# Altium schematic sheet main.SchDoc
size A3
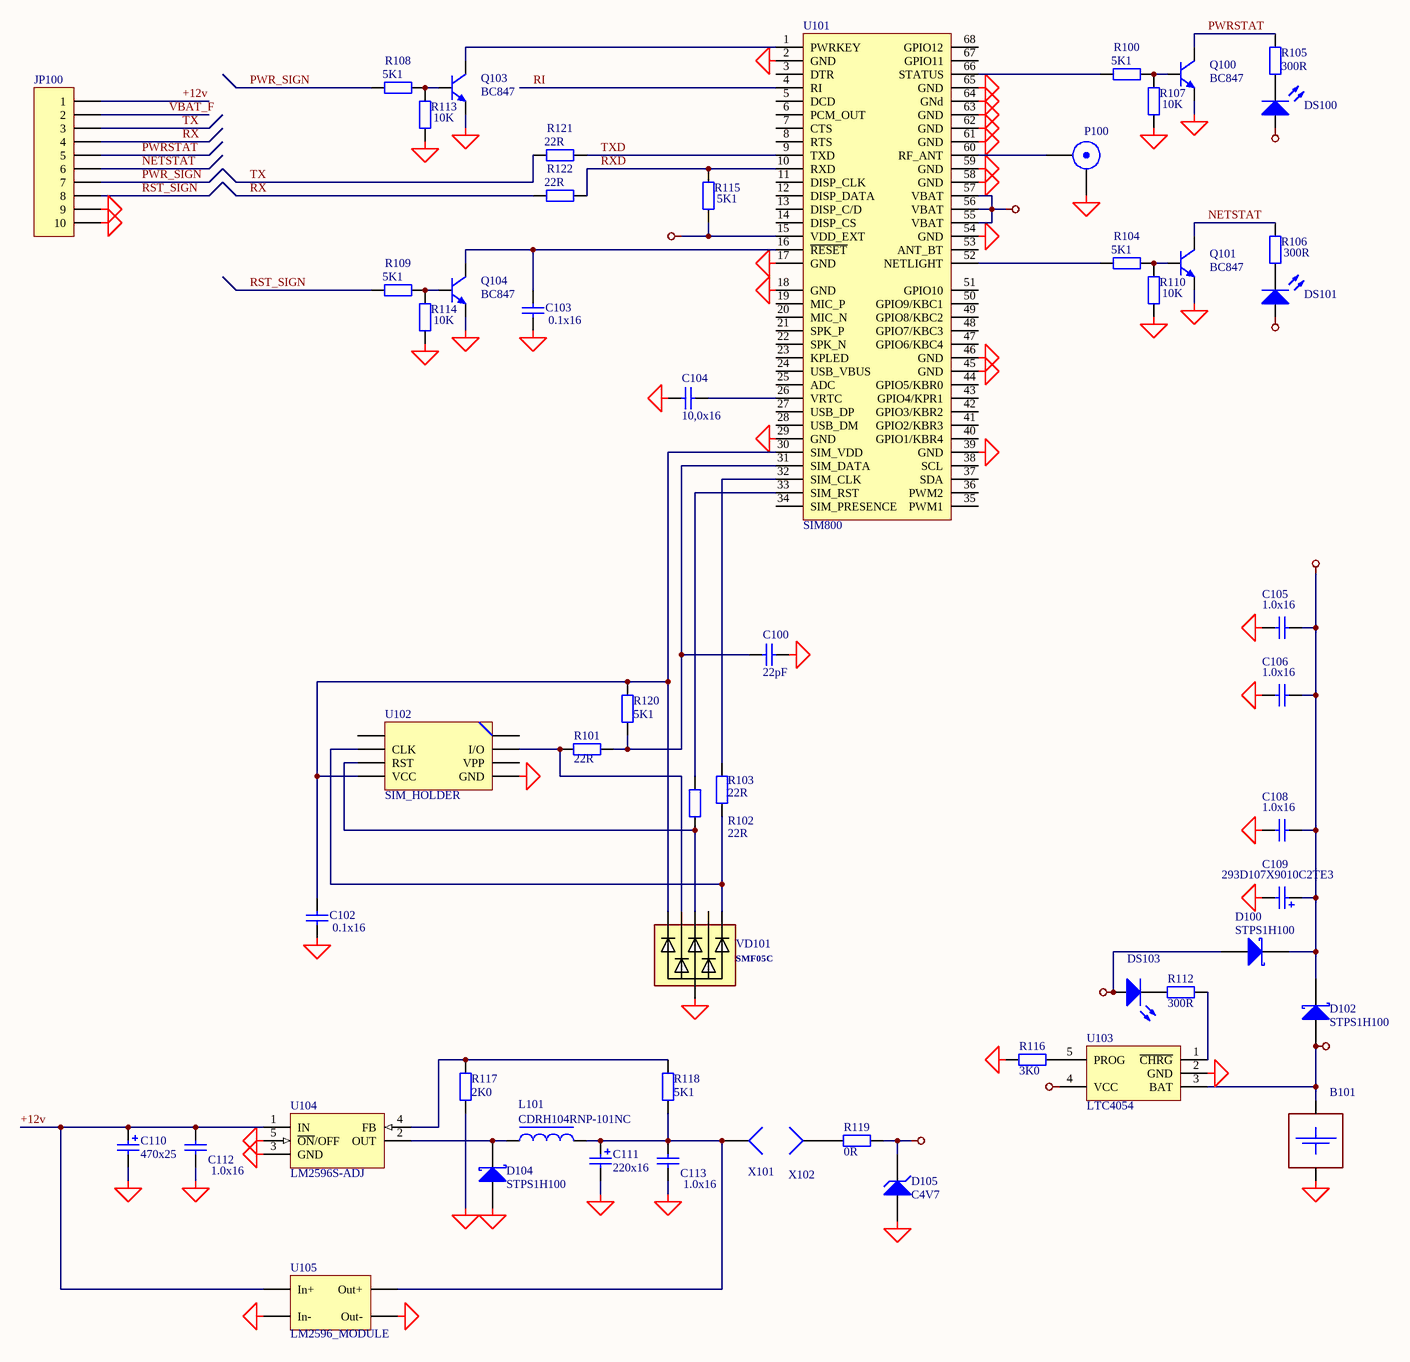
[diagram p0: main.SchDoc]

## Parts
B101  BAT18650_HOLDER  [BAT18650_HOLDER]  (value not drawn)
C100  22pF  [_1206]
C102  0.1x16  [_1206]
C103  0.1x16  [_1206]
C104  10,0x16  [_1206]
C105  1.0x16  [_1206]
C106  1.0x16  [_1206]
C108  1.0x16  [_1206]
C109  293D107X9010C2TE3  [CAP_EL_6_3]
C110  470x25  [el5]
C111  220x16  [el3]
C112  1.0x16  [_1206]
C113  1.0x16  [_1206]
D100  STPS1H100  [MBRS140]
D102  STPS1H100  [MBRS140]
D104  STPS1H100  [MBRS140]
D105  C4V7  [_1206d]
DS100  LED0  [el3]  (value not drawn)
DS101  LED0  [el3]  (value not drawn)
DS103  LED0  [el3]  (value not drawn)
JP100  PLDH-10  [HDR2X5]  (value not drawn)
L101  CDRH104RNP-101NC  [CDRH104R]
P100  SMB  [SMB_V-RJ45]  (value not drawn)
Q100  BC847  [SO-G3]
Q101  BC847  [SO-G3]
Q103  BC847  [SO-G3]
Q104  BC847  [SO-G3]
R100  5K1  [_1206]
R101  22R  [_1206]
R102  22R  [_1206]
R103  22R  [_1206]
R104  5K1  [_1206]
R105  300R  [_1206]
R106  300R  [_1206]
R107  10K  [_1206]
R108  5K1  [_1206]
R109  5K1  [_1206]
R110  10K  [_1206]
R112  300R  [_1206]
R113  10K  [_1206]
R114  10K  [_1206]
R115  5K1  [_1206]
R116  3K0  [_1206]
R117  2K0  [_1206]
R118  5K1  [_1206]
R119  0R  [_1206]
R120  5K1  [_1206]
R121  22R  [_1206]
R122  22R  [_1206]
U101  SIM800  [SIM800]
U102  SIM_HOLDER  [SIM_HOLDER_1]
U103  LTC4054  [SO-G5/P.95]
U104  LM2596S-ADJ  [SIP-G5/Y2.1]
U105  LM2596_MODULE  [LM2596_MODULE_1]
VD101  SMF05C  [sot363]
X101  Socket  [PIN1]  (value not drawn)
X102  Socket  [PIN1]  (value not drawn)

## Nets
+5v: D100.1(A) D105.2(K) DS103.1(A) R119.2 U103.4(VCC)
GND: B101.2(-) C100.1 C102.1 C103.1 C104.2 C105.1 C106.1 C108.1 C109.2 C110.2 C111.2 C112.1 C113.1 D104.1(A) D105.1(A) JP100.9 JP100.10 P100.2(Y) Q100.2(E) Q101.2(E) Q103.2(E) Q104.2(E) R107.2 R110.2 R113.2 R114.2 R116.2 R117.2 U101.2(GND) U101.17(GND) U101.18(GND) U101.29(GND) U101.39(GND) U101.45(GND) U101.46(GND) U101.54(GND) U101.58(GND) U101.59(GND) U101.61(GND) U101.62(GND) U101.63(GND) U101.64(GNd) U101.65(GND) U102.5(GND) U103.2(GND) U104.3(GND) U104.5(~{ON}/OFF) U105.2(In-) U105.3(Out-) VD101.2
VBAT: C105.2 C106.2 C108.2 C109.1 D100.2(K) D102.2(K) DS100.1(A) DS101.1(A) U101.55(VBAT) U101.56(VBAT) U101.57(VBAT)
VBAT_F: B101.1(+) D102.1(A) JP100.2 U103.3(BAT)
VDD_EXT: R115.2 U101.15(VDD_EXT)
+12v: C110.1 C112.2 JP100.1 U104.1(IN) U105.1(In+)
NETSTAT: JP100.6 Q101.3(C) R106.1
PWR_SIGN: JP100.7 R108.2
PWRSTAT: JP100.5 Q100.3(C) R105.2
RI: U101.4(RI)
RST_SIGN: JP100.8 R109.2
RX: JP100.4 R122.2
RXD: R115.1 R122.1 U101.10(RXD)
TX: JP100.3 R121.2
TXD: R121.1 U101.9(TXD)
NetC100_2: C100.2 R101.1 R120.2 U101.31(SIM_DATA)
NetC102_2: C102.2 R120.1 U101.30(SIM_VDD) U102.4(VCC) VD101.1
NetC103_2: C103.2 Q104.3(C) U101.16(~{RESET})
NetC104_1: C104.1 U101.26(VRTC)
NetC111_1: C111.1 C113.2 L101.2 R118.2 U105.4(Out+) X101.1
NetD104_2: D104.2(K) L101.1 U104.2(OUT)
NetDS100_2: DS100.2(K) R105.1
NetDS101_2: DS101.2(K) R106.2
NetDS103_2: DS103.2(K) R112.2
NetP100_1: P100.1(X) U101.60(RF_ANT)
NetQ100_1: Q100.1(B) R100.1 R107.1
NetQ101_1: Q101.1(B) R104.1 R110.1
NetQ103_1: Q103.1(B) R108.1 R113.1
NetQ103_3: Q103.3(C) U101.1(PWRKEY)
NetQ104_1: Q104.1(B) R109.1 R114.1
NetR100_2: R100.2 U101.66(STATUS)
NetR101_2: R101.2 U102.7(I/O) VD101.3
NetR102_1: R102.1 U101.33(SIM_RST)
NetR102_2: R102.2 U102.3(RST) VD101.4
NetR103_1: R103.1 U101.32(SIM_CLK)
NetR103_2: R103.2 U102.2(CLK) VD101.6
NetR104_2: R104.2 U101.52(NETLIGHT)
NetR112_1: R112.1 U103.1(~{CHRG})
NetR116_1: R116.1 U103.5(PROG)
NetR117_1: R117.1 R118.1 U104.4(FB)
NetR119_1: R119.1 X102.1

Not connected (* = marked no-connect by the designer): U101 3(DTR) 5(DCD) 6(PCM_OUT) 7(CTS) 8(RTS) 11(DISP_CLK) 12(DISP_DATA) 13(DISP_C/D) 14(DISP_CS) 19(MIC_P) 20(MIC_N) 21(SPK_P) 22(SPK_N) 23(KPLED) 24(USB_VBUS) 25(ADC) 27(USB_DP) 28(USB_DM) 34(SIM_PRESENCE) 35(PWM1) 36(PWM2) 37(SDA) 38(SCL) 40(GPIO1/KBR4) 41(GPIO2/KBR3) 42(GPIO3/KBR2) 43(GPIO4/KPR1) 44(GPIO5/KBR0) 47(GPIO6/KBC4) 48(GPIO7/KBC3) 49(GPIO8/KBC2) 50(GPIO9/KBC1) 51(GPIO10) 53(ANT_BT) 67(GPIO11) 68(GPIO12); U102 1 6(VPP) 8; VD101 5

## Library data of the parts
C100 C102-C106 C108 = Cap Semi: Capacitor; Manufacturer: Generic Components; Class I: Passive; Value: 0,1; Published: 8-Jun-2000; Revision: July-2002: Re-released for DXP Platform.; Publisher: Altium Limited; Class II: Capacitor
C109 = Cap Pol1: Polarized Capacitor (Radial); Manufacturer: Generic Components; Class I: Passive; Value: 10,0x25; Published: 8-Jun-2000; Revision: July-2002: Re-released for DXP Platform.; Publisher: Altium Limited; Class II: Capacitor
C110 C111 = Cap Pol: Polarized Capacitor (Radial); Manufacturer: Generic Components; Class I: Passive; Published: 8-Jun-2000; Revision: July-2002: Re-released for DXP Platform.; Publisher: Altium Limited; Class II: Capacitor
  C110: Value: 470x25
  C111: Value: 220x16
C112 C113 = Cap: Capacitor; Manufacturer: Generic Components; Class I: Passive; Value: 1.0; Published: 8-Jun-2000; Revision: July-2002: Re-released for DXP Platform.; Publisher: Altium Limited; Class II: Capacitor
D100 D102 D104 = 10BQ015: Schottky Rectifier; Manufacturer: International Rectifier; Revision 1: 10-July-2000: SIM Model Added.; Revision 2: July-2002: Re-released for DXP Platform.; Class I: Discrete; Class II: Rectifier - Schottky; Published: 8-Jun-2000; Datasheet: Latest Revision: PD-2.396A; Package Reference: DO-214AA; Publisher: Altium Limited
D105 = D Zener: Zener Diode; Manufacturer: Generic Components; Class I: Discrete; Class II: Diode - Zener; Published: 8-Jun-2000; Revision: July-2002: Re-released for DXP Platform.; Publisher: Altium Limited
DS100 DS101 DS103 = LED0: Typical INFRARED GaAs LED; Manufacturer: Generic Components; Class I: Optoelectronic; Published: 8-Jun-2000; Revision: July-2002: Re-released for DXP Platform.; Publisher: Altium Limited; Class II: LED
JP100 = Header 10: Header, 10-Pin; Manufacturer: Generic Components; Class I: Connector; Revision: July-2002: Re-released for DXP Platform.; Publisher: Altium Limited
L101 = Inductor Konstr 2: Magnetic-Core Inductor; Manufacturer: Generic Components; Class I: Passive; Published: 24-Mar-1999; Revision: July-2002: Re-released for DXP Platform.; Publisher: Altium Limited; Class II: Inductor
P100 = SMB: SMB Straight Connector; Manufacturer: Generic Components; Class II: RF Coaxial; Revision: July-2002: Re-released for DXP Platform.; Publisher: Altium Limited; Class I: Connector
Q100 Q101 Q103 Q104 = BC847ALT1: General Purpose Transistor NPN Silicon; Manufacturer: Motorola; Package Information: Latest Revision: 1997; Class I: Discrete; Class II: BJT - Low Power; Published: 29-Sep-2000; Revision: July-2002: Re-released for DXP Platform.; Datasheet: Latest Revision: 1997; Package Reference: 318-08; Publisher: Altium Limited
R100 R104 R108 R109 R121 R122 = Res2: Resistor; Manufacturer: Generic Components; Class I: Passive; Value: 1K; Published: 8-Jun-2000; Revision: July-2002: Re-released for DXP Platform.; Publisher: Altium Limited; Class II: Resistor
R101-R103 R117-R120 = Res2: Resistor; Manufacturer: Generic Components; Class I: Passive; Value: 10K; Rule: Undefined; Published: 8-Jun-2000; Revision: July-2002: Re-released for DXP Platform.; Publisher: Altium Limited; Class II: Resistor
R105 R106 R112 R115 R116 = Res2: Resistor; Manufacturer: Generic Components; Class I: Passive; Value: 10K; Published: 8-Jun-2000; Revision: July-2002: Re-released for DXP Platform.; Publisher: Altium Limited; Class II: Resistor
R107 R110 R113 R114 = Res2: Resistor; Manufacturer: Generic Components; Class I: Passive; Published: 8-Jun-2000; Revision: July-2002: Re-released for DXP Platform.; Publisher: Altium Limited; Class II: Resistor; Value: 10K
U104 = LM2596S-ADJ: Simple Switcher Power Converter 150 kHz 3A Step Down Voltage Regulator; Manufacturer: National Semiconductor; Class I: Power Management; Class II: Switching Regulator; Note: Tab is connected to GND; Published: 15-Apr-2002; Datasheet: Latest Revision: Dec-1997; Package Reference: TS5B; Publisher: Altium Limited
X101 X102 = Socket: Manufacturer: Generic Components; Class I: Connector; Revision: July-2002: Re-released for DXP Platform.; Publisher: Altium Limited
VD101 = SMF05C: ManufacturerPartNumber: SMF05C